# Altium schematic sheet MAIN_POWER.SchDoc
size A3; SheetNumber: 19; SheetTotal: 22
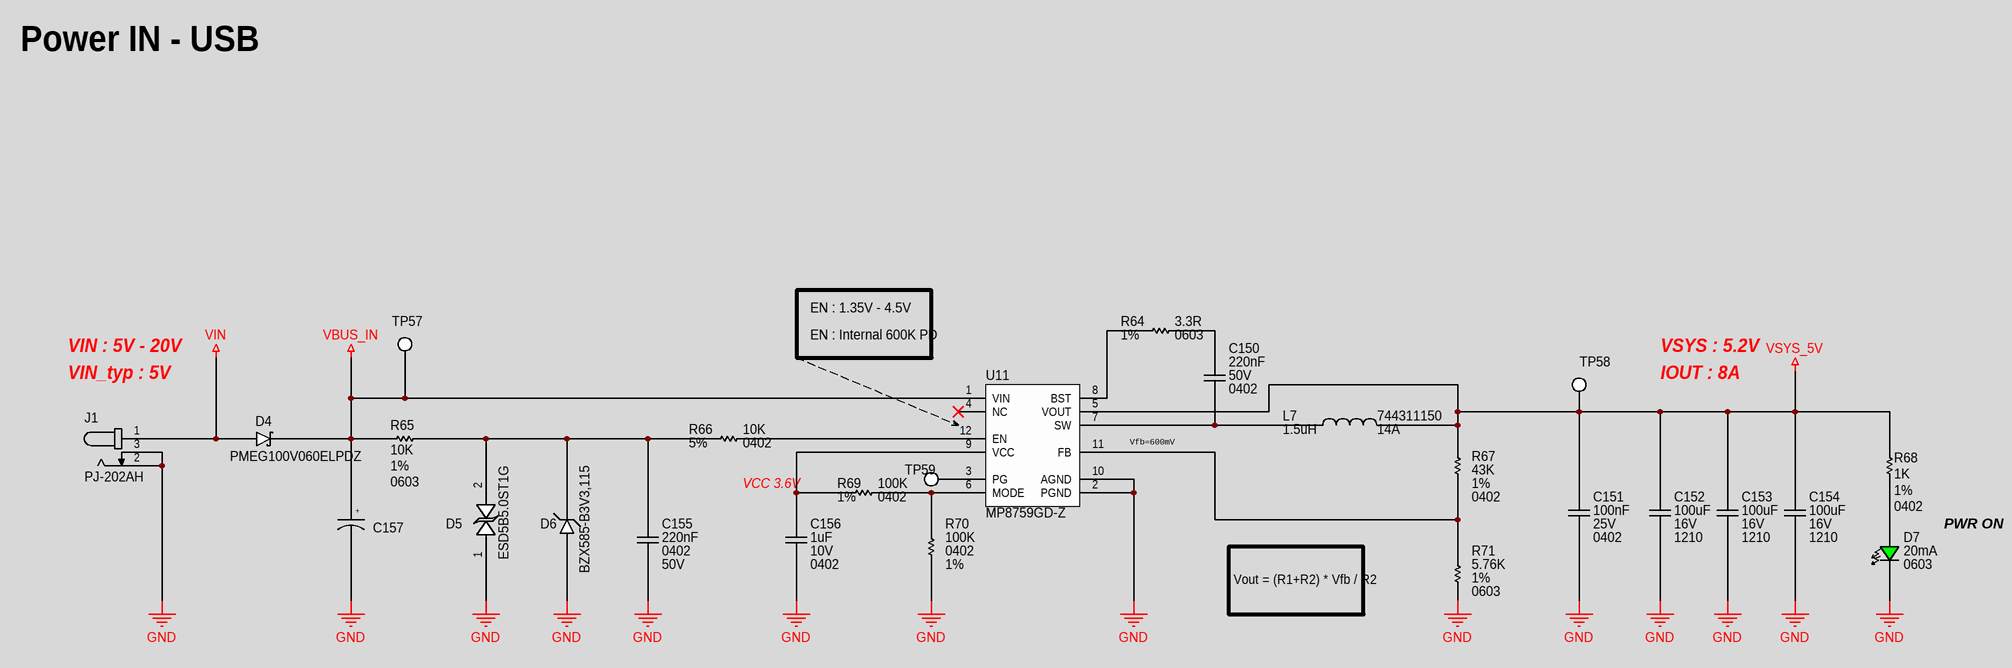
[diagram p0: MAIN_POWER.SchDoc]

## Parts
C150  Case/Package: 0402  Voltage Rating (DC): 50V  Capacitance: 220nF  [CAP_0402_CAPC1005X05N]  (hidden comment: GRM155R61H224KE01W)
C151  Capacitance: 100nF  Voltage Rating: 25V  Case/Package: 0402  [CAP_0402_CAPC1005X05N]  (hidden comment: CC0402KRX5R8BB104)
C152  Voltage Rating: 16V  Capacitance: 100uF  Case/Package: 1210  [CAP_1210_CAPC3225X270N]  (hidden comment: EMK325ABJ107MM-T)
C153  Voltage Rating: 16V  Capacitance: 100uF  Case/Package: 1210  [CAP_1210_CAPC3225X270N]  (hidden comment: EMK325ABJ107MM-T)
C154  Voltage Rating: 16V  Capacitance: 100uF  Case/Package: 1210  [CAP_1210_CAPC3225X270N]  (hidden comment: EMK325ABJ107MM-T)
C155  Case/Package: 0402  Voltage Rating (DC): 50V  Capacitance: 220nF  [CAP_0402_CAPC1005X05N]  (hidden comment: GRM155R61H224KE01W)
C156  Voltage Rating: 10V  Capacitance: 1uF  Case/Package: 0402  [CAP_0402_CAPC1005X05N]  (hidden comment: GRM155C81A105KA12D)
C157  UUD1H101MNL1GS  [CAP_POLA_UD(8X10)]  (value not drawn)
D4  PMEG100V060ELPDZ  [DIO_SCKTY_PMEG060V100EPDAZ]
D5  ESD5B5.0ST1G  [DIO_TVS_SODFL1608X70N]
D6  BZX585-B3V3,115  [DIO_ZENER_BZX585B3V3115]
D7  Test Current: 20mA  Case/Package: 0603  [LED_0603-GREEN]  (hidden comment: LTST-C191KGKT)
J1  PJ-202AH  [CONN_CUI_PJ-202AH]
L7  744311150  Saturation Current: 14A  Inductance: 1.5uH  [IND_WE-HCI_7030/7040/705023]
R64  Tolerance: 1%  Resistance: 3.3R  Case Code (Imperial): 0603  [RES_0603_RESC1608X04N]  (hidden comment: RK73H1JTTD3R30F)
R65  Resistance: 10K  Tolerance: 1%  Case/Package: 0603  [RES_0603_RESC1608X04N]  (hidden comment: AC0603FR-1010KL)
R66  Tolerance: 5%  Resistance: 10K  Case/Package: 0402  [RES_0402_RESC1005X04N]  (hidden comment: ERJ-2GEJ103X)
R67  Tolerance: 1%  Resistance: 43K  Case/Package: 0402  [RES_0402_RESC1005X04N]  (hidden comment: CRCW040243K0FKED)
R68  Resistance: 1K  Tolerance: 1%  Case/Package: 0402  [RES_0402_RESC1005X04N]  (hidden comment: ERJ-2RKF1001X)
R69  Resistance: 100K  Tolerance: 1%  Case/Package: 0402  [RES_0402_RESC1005X04N]  (hidden comment: RC0402FR-07100KL)
R70  Resistance: 100K  Tolerance: 1%  Case/Package: 0402  [RES_0402_RESC1005X04N]  (hidden comment: RC0402FR-07100KL)
R71  Tolerance: 1%  Resistance: 5.76K  Case/Package: 0603  [RES_0603_RESC1608X04N]  (hidden comment: RC0603FR-075K76L)
TP57  NO COMPONENT  [TP_PAD_0.8MM_SMD_ROUND]  (value not drawn)  (no BOM)
TP58  NO COMPONENT  [TP_PAD_0.8MM_SMD_ROUND]  (value not drawn)  (no BOM)
TP59  NO COMPONENT  [TP_PAD_1.6MM_SMD_ROUND]  (value not drawn)  (no BOM)
U11  MP8759GD-Z  [IC_REG_MP8759GDZ]

## Nets
GND: C151.1 C152.1 C153.1 C154.1 C155.1 C156.1 C157.2 D5.1(A1) D6.2(A) D7.1(C) J1.2 J1.3 R70.1 R71.1 U11.2(PGND) U11.10(AGND)
VBUS_IN: C157.1 D4.K R65.2 TP57.1 U11.1(VIN)
VIN: D4.A J1.1
VSYS_5V: C151.2 C152.2 C153.2 C154.2 L7.2 R67.2 R68.2 TP58.1 U11.5(VOUT)
NetC150_1: C150.1 L7.1 U11.7(SW)
NetC150_2: C150.2 R64.2
NetC155_2: C155.2 D5.2(A2) D6.1(K) R65.1 R66.1
NetC156_2: C156.2 R69.1 U11.9(VCC)
NetD7_2: D7.2(A) R68.1
NetR64_1: R64.1 U11.8(BST)
NetR66_2: R66.2 U11.12(EN)
NetR67_1: R67.1 R71.2 U11.11(FB)
NetR69_2: R69.2 R70.2 U11.6(MODE)
NetTP59_1: TP59.1 U11.3(PG)

Not connected (* = marked no-connect by the designer): U11 4(NC)*

## Notes on the sheet
- Power IN - USB
- VIN : 5V - 20V
- EN : 1.35V - 4.5V
- EN : Internal 600K PD
- VSYS : 5.2V
- VIN_typ : 5V
- IOUT : 8A
- VCC 3.6V
- Vfb=600mV
- PWR ON
- Vout = (R1+R2) * Vfb / R2
- PCB Des :
- Approv By :
- Project Title :
- Sheet Title :
- Date :
- PCB Version :
- Size :
- A3
- Page :
- PCB Revision :
- (in symbol CAP_100UF_50V_POL) +

## Library data of the parts
C150 C155 = CAP_0.22UF_50V_X5R_0402: Multilayer Ceramic Capacitor, 0.22 uF, 50 VDC, ± 10%, X5R, 0402 [1005 Metric]; Manufacturer: Murata; Material: 4241ConductorMaterial; Dielectric: 1537DielectricType; Supplier 1: Digi-Key; Manufacturer Part Number: GRM155R61H224KE01W; RoHS: No; Category: Ceramic Capacitors; Stock 1: 74638; Pricing 1: 1=0.1, 10=0.048, 50=0.0272, 100=0.0212, 500=0.01592, 1000=0.01251, 2500=0.01138, 5000=0.01046 (USD); Min Operating Temperature: -55°C; Max Operating Temperature: 85°C; Voltage Rating: 50V; Length: 1mm; Width: 500um; Height: 550um; Thickness: 500um; Supplier Part Number 1: 490-GRM155R61H224KE01WCT-ND
C151 = CAP_100NF_25V_X7R_0402: Multilayer Ceramic Capacitor, 0.1 uF, 25 V, ± 10%, X7R, 0402 [1005 Metric]; Manufacturer: Yageo; Material: 4241ConductorMaterial; Dielectric: X5R; Temperature Coefficient: 30ppm/°C; Supplier 1: Digikey; Manufacturer Part Number: CC0402KRX5R8BB104; RoHS: Yes; Category: Ceramic Capacitors; Stock 1: 3706055; Pricing 1: 1=0.1, 10=0.037, 50=0.021, 100=0.0162, 500=0.01224, 1000=0.00961, 2500=0.00874, 5000=0.00804 (USD); Mount: Surface Mount; Case Code (Metric): 1005; Case Code (Imperial): 0402; Min Operating Temperature: -55°C; Max Operating Temperature: 85°C; Tolerance: 10%; Packaging: Tape and Reel; Voltage Rating (DC): 25V; Series: CC; RoHS Compliant: Yes; Lead Free: 5697LeadFree; Halogen Free: 5694HalogenFree; ComponentLink1URL: http://www.mouser.com/ds/2/447/UPY-GPHC_X5R_4V-to-50V_25-1131599.pdf?src-supplier=Mouser; ComponentLink1Description: http://www.mouser.com/ds/2/447/UPY-GPHC_X5R_4V-to-50V_25-1131599.pdf?src-supplier=Mouser; ComponentLink2URL: https://datasheet.octopart.com/CC0402KRX5R8BB104-Yageo-datasheet-137700082.pdf?src-supplier=Future+Electronics; ComponentLink2Description: https://datasheet.octopart.com/CC0402KRX5R8BB104-Yageo-datasheet-137700082.pdf?src-supplier=Future+Electronics; ComponentLink3URL: http://www.yageo.com/documents/recent/UPY-GPHC_X5R_4V-to-50V_25.pdf?src-supplier=Digikey; ComponentLink3Description: http://www.yageo.com/documents/recent/UPY-GPHC_X5R_4V-to-50V_25.pdf?src-supplier=Digikey; ComponentLink4URL: https://datasheet.octopart.com/CC0402KRX5R8BB104-Yageo-datasheet-140260304.pdf?src-supplier=Newark; ComponentLink4Description: https://datasheet.octopart.com/CC0402KRX5R8BB104-Yageo-datasheet-140260304.pdf?src-supplier=Newark; ComponentLink5URL: https://datasheet.octopart.com/CC0402KRX5R8BB104-Yageo-datasheet-170350636.pdf?src-supplier=Future+Electronics; ComponentLink5Description: https://datasheet.octopart.com/CC0402KRX5R8BB104-Yageo-datasheet-170350636.pdf?src-supplier=Future+Electronics; ComponentLink6URL: http://www.yageo.com/documents/recent/UPY-GPHC_X5R_4V-to-50V-16.pdf?src-supplier=Future+Electronics; ComponentLink6Description: http://www.yageo.com/documents/recent/UPY-GPHC_X5R_4V-to-50V-16.pdf?src-supplier=Future+Electronics; Supplier Part Number 1: 311-1697-6-ND
C152-C154 = CAP_100UF_16V_X5R_1210: Multilayer Ceramic Capacitor, 100 uF, 16 V, ± 20%, X5R, 1210 [3225 Metric]; Manufacturer: Taiyo Yuden; Material: 4241ConductorMaterial; Supplier 1: Digikey; Manufacturer Part Number: EMK325ABJ107MM-T; RoHS: Yes; Category: Ceramic Capacitors; Stock 1: 503358; Pricing 1: 1=1.73, 10=1.295, 50=1.1816, 100=0.9681 (USD); Mount: Surface Mount; Case Code (Metric): 3225; Case Code (Imperial): 1210; Min Operating Temperature: -55°C; Max Operating Temperature: 85°C; Tolerance: 20%; Packaging: Tape and Reel; Package Quantity: 500; Voltage Rating (DC): 16V; Dielectric: X5R; Termination: SMD/SMT; Series: M; Length: 3.2mm; Width: 2.5mm; Height: 2.5mm; Reach SVHC Compliant: No; RoHS Compliant: Yes; ComponentLink1URL: http://www.farnell.com/datasheets/1497285.pdf?src-supplier=Farnell; ComponentLink1Description: http://www.farnell.com/datasheets/1497285.pdf?src-supplier=Farnell; Supplier Part Number 1: 587-3152-1-ND
C156 = CAP_1UF_10V_X6S_0402: 0402 10 V 1 uF ±10% Tolerance X6S Multilayer Ceramic Capacitor; Manufacturer: Murata; Supplier 1: Digikey; Manufacturer Part Number: GRM155C81A105KA12D; RoHS: Yes; Category: Ceramic Capacitors; Stock 1: 2486564; Pricing 1: 1=0.1, 10=0.045, 50=0.026, 100=0.0202, 500=0.01518, 1000=0.01192, 2500=0.01084, 5000=0.00997 (USD); Mount: Surface Mount; Case Code (Metric): 1005; Material: Ceramic; Case Code (Imperial): 0402; Weight: 0.000212oz; Min Operating Temperature: -55°C; Max Operating Temperature: 105°C; Dielectric: X6S; Packaging: Tape and Reel; Termination: SMD/SMT; Voltage Rating (DC): 10V; Package Quantity: 10000; Series: GRM; Length: 1mm; Width: 0.5mm; Height: 0.5mm; Thickness: 0.022inch; Lead Free: Lead Free; RoHS Compliant: Yes; ComponentLink1URL: http://www.mouser.com/ds/2/281/c02e-2905.pdf?src-supplier=Mouser; ComponentLink1Description: http://www.mouser.com/ds/2/281/c02e-2905.pdf?src-supplier=Mouser; ComponentLink2URL: https://datasheet.octopart.com/GRM155C81A105KA12D-Murata-datasheet-22122223.pdf?src-supplier=Future+Electronics; ComponentLink2Description: https://datasheet.octopart.com/GRM155C81A105KA12D-Murata-datasheet-22122223.pdf?src-supplier=Future+Electronics; ComponentLink3URL: https://datasheet.octopart.com/GRM155C81A105KA12D-Murata-datasheet-149522926.pdf?src-supplier=Newark; ComponentLink3Description: https://datasheet.octopart.com/GRM155C81A105KA12D-Murata-datasheet-149522926.pdf?src-supplier=Newark; ComponentLink4URL: http://search.murata.co.jp/Ceramy/image/img/A01X/G101/ENG/GRM155C81A105KA12-01.pdf?src-supplier=Digikey; ComponentLink4Description: http://search.murata.co.jp/Ceramy/image/img/A01X/G101/ENG/GRM155C81A105KA12-01.pdf?src-supplier=Digikey; ComponentLink5URL: http://search.murata.co.jp/Ceramy/image/img/A01X/partnumbering_e_01.pdf?src-supplier=Digikey; ComponentLink5Description: http://search.murata.co.jp/Ceramy/image/img/A01X/partnumbering_e_01.pdf?src-supplier=Digikey; ComponentLink6URL: https://datasheet.octopart.com/GRM155C81A105KA12D-Murata-datasheet-165579666.pdf?src-supplier=TME; ComponentLink6Description: https://datasheet.octopart.com/GRM155C81A105KA12D-Murata-datasheet-165579666.pdf?src-supplier=TME; Supplier Part Number 1: 490-12699-6-ND; Tolerance: 10%
C157 = CAP_100UF_50V_POL: Radial Can - SMD ALUMINUM ELECTROLYTIC CAPACITOR UUD 50V 100muF ±20% 0.315Dia 8.00mm; Manufacturer: Nichicon; Dielectric Material: Aluminium; Ripple Current (AC): 300mA; Impedance: 340mR; Capacitance: 100uF; Leakage Current: 3uA; Life (Hours): 5000Hour; Dissipation Factor: 0.14%; Polarity: 5066Direction; Lead Diameter: 1.1mm; Supplier 1: Mouser; Manufacturer Part Number: UUD1H101MNL1GS; RoHS: Yes; Category: Aluminum Electrolytic Capacitors; Stock 1: 2204; Pricing 1: 1=0.53, 10=0.313, 50=0.313, 100=0.202, 500=0.202, 1000=0.171, 2500=0.151, 10000=0.138, 25000=0.136, 50000=0.131 (USD); Case/Package: Radial; Number of Pins: 2; Min Operating Temperature: -55°C; Max Operating Temperature: 105°C; Tolerance: 20%; Voltage Rating (DC): 50V; Package Quantity: 500; Ripple Current: 300mA; Packaging: Tape and Reel; Voltage Rating: 50V; Termination: SMD/SMT; Voltage: 50V; Series: UD; Construction: Cylindrical; Voltage Rating (AC): 50V; Diameter: 8mm; Length: 10mm; Height: 10mm; Lead Pitch: 3.1mm; Height - Seated (Max): 0.394inch; Radiation Hardening: No; Reach SVHC Compliant: No; Lead Free: Lead Free; RoHS Compliant: Yes; ComponentLink1URL: https://datasheet.ciiva.com/11781/0900766b80fa39e7-11781901.pdf?src-supplier=Rs; ComponentLink1Description: https://datasheet.ciiva.com/11781/0900766b80fa39e7-11781901.pdf?src-supplier=Rs; ComponentLink2URL: https://datasheet.ciiva.com/28458/e-ud-28458117.pdf?src-supplier=Element14; ComponentLink2Description: https://datasheet.ciiva.com/28458/e-ud-28458117.pdf?src-supplier=Element14; ComponentLink3URL: https://datasheet.ciiva.com/28458/1910936-28458133.pdf?src-supplier=Element14; ComponentLink3Description: https://datasheet.ciiva.com/28458/1910936-28458133.pdf?src-supplier=Element14; ComponentLink4URL: https://datasheet.ciiva.com/7781/66055-7781450.pdf?src-supplier=Element14; ComponentLink4Description: https://datasheet.ciiva.com/7781/66055-7781450.pdf?src-supplier=Element14; ComponentLink5URL: https://datasheet.ciiva.com/5362/e-ud-5362134.pdf?src-supplier=Mouser; ComponentLink5Description: https://datasheet.ciiva.com/5362/e-ud-5362134.pdf?src-supplier=Mouser; Supplier Part Number 1: 647-UUD1H101MNL
D4 = DIO_SCTKY_100V_6A_PMEG100V060ELPDZ: DIODESCHOTTKY100V6ACFP15; Manufacturer: Nexperia; Supplier 1: Digikey; Manufacturer Part Number: PMEG100V060ELPDZ; RoHS: Yes; Category: Schottky Diodes; Stock 1: 60422; Pricing 1: 1=0.58, 10=0.504, 100=0.3491, 500=0.29166 (USD); RoHS Compliant: Yes; ComponentLink1URL: http://www.farnell.com/datasheets/2341403.pdf?src-supplier=Farnell; ComponentLink1Description: http://www.farnell.com/datasheets/2341403.pdf?src-supplier=Farnell; ComponentLink2URL: https://datasheet.octopart.com/PMEG100V060ELPDZ-Nexperia-datasheet-87796136.pdf?src-supplier=Future+Electronics; ComponentLink2Description: https://datasheet.octopart.com/PMEG100V060ELPDZ-Nexperia-datasheet-87796136.pdf?src-supplier=Future+Electronics
D5 = DIO_TVS_5.8V_ESD5B5.0ST1G_1: ESD5B5.0S Series 5.8 V 50 W 32 pF SMT ESD Protection Diode - SOD-523
D6 = DIO_ZENER_3.3V_300mW_BZX585-B3V3,115: DIODE ZENER 3.3V 300MW SOD523; Manufacturer: Nexperia; Supplier 1: Mouser; Manufacturer Part Number: BZX585-B3V3,115; RoHS: Yes; Category: Zener Diodes; Stock 1: 47007; Pricing 1: 1=0.38, 10=0.258, 50=0.258, 100=0.105, 1000=0.073, 3000=0.054, 9000=0.048, 10000=0.048, 24000=0.044, 45000=0.042, 99000=0.037 (USD); RoHS Compliant: Yes; ComponentLink1URL: http://www.farnell.com/datasheets/2174102.pdf?src-supplier=Farnell; ComponentLink1Description: http://www.farnell.com/datasheets/2174102.pdf?src-supplier=Farnell; ComponentLink2URL: https://assets.nexperia.com/documents/data-sheet/BZX585_SERIES.pdf?src-supplier=Digikey; ComponentLink2Description: https://assets.nexperia.com/documents/data-sheet/BZX585_SERIES.pdf?src-supplier=Digikey; ComponentLink3URL: https://datasheet.octopart.com/BZX585-B3V3%2C115-Nexperia-datasheet-81456219.pdf?src-supplier=Future+Electronics; ComponentLink3Description: https://datasheet.octopart.com/BZX585-B3V3%2C115-Nexperia-datasheet-81456219.pdf?src-supplier=Future+Electronics; Supplier Part Number 1: 771-BZX585-B3V3115
D7 = LED_DIO_GREEN_20mA_0603: LTST-C191KGKT Lite-On LED, green, 18-71mcd, 130, 1.9V-2.4V SMD, 0603 1.6x0.8x0.55mm RoHS; Manufacturer: Vishay Lite-On; Lens Color: Colorless; Luminous Intensity: 35mcd; Viewing Angle: 130°; Forward Voltage: 2V; Dominant Wavelength: 571nm; Lens Transparency: Clear; Wavelength: 574nm; Lens Style: Flat,Rectangular,Colorless; Number of LEDs: 1; Max Power Dissipation: 75mW; Lens Size: 0.8mm; Supplier 1: Digi-Key; Manufacturer Part Number: LTST-C191KGKT; RoHS: Yes; Stock 1: 1556161; Pricing 1: 1=0.26, 10=0.143, 100=0.0663, 500=0.0612, 1000=0.04794, 2000=0.04693 (USD); Mount: Surface Mount; Number of Pins: 2; Color: Green; Case Code (Metric): 1608; Case Code (Imperial): 0603; Min Operating Temperature: -55°C; Max Operating Temperature: 85°C; Packaging: Tape and Reel; Series: -; Length: 1.6mm; Width: 0.8mm; Height: 0.65mm; RoHS Compliant: Yes; Lead Free: Lead Free; ComponentLink1URL: https://datasheet.ciiva.com/2109/ltst-c191kgkt-2109973.pdf?src-supplier=Digi-Key; ComponentLink1Description: https://datasheet.ciiva.com/2109/ltst-c191kgkt-2109973.pdf?src-supplier=Digi-Key; Supplier Part Number 1: 160-1446-1-ND
J1 = CONN_DC_JACK_2X6.5mm_PJ-202AH: 2.0 x 6.5 mm, 5.0 A, Horizontal, Through Hole, Kinked Pins, Dc Power Jack Connector; Manufacturer: CUI Devices; Body Color: Black; Shielding: Unshielded; Gender: Male; Supplier 1: Digi-Key; Manufacturer Part Number: PJ-202AH; RoHS: Yes; Category: Power Connectors; Stock 1: 143167; Pricing 1: 1=0.78, 25=0.6528, 100=0.5988, 500=0.48902, 2500=0.40274, 10000=0.36162 (USD); Mount: Through Hole; Contact Plating: Silver; Contact Material: Brass; Housing Material: PBT; Min Operating Temperature: -25°C; Max Operating Temperature: 85°C; Connector Type: Jack; Termination: Kinked Pin; Series: -; Flammability Rating: UL94 V-0; ComponentLink1URL: https://datasheet.octopart.com/PJ-202AH-CUI-Devices-datasheet-137760703.pdf?src-supplier=Future+Electronics; ComponentLink1Description: https://datasheet.octopart.com/PJ-202AH-CUI-Devices-datasheet-137760703.pdf?src-supplier=Future+Electronics; ComponentLink2URL: https://datasheet.octopart.com/PJ-202AH-CUI-datasheet-54017.pdf?src-supplier=Digi-Key; ComponentLink2Description: https://datasheet.octopart.com/PJ-202AH-CUI-datasheet-54017.pdf?src-supplier=Digi-Key; ComponentLink3URL: https://datasheet.octopart.com/PJ-202AH-CUI-Devices-datasheet-141002001.pdf?src-supplier=Electro+Sonic; ComponentLink3Description: https://datasheet.octopart.com/PJ-202AH-CUI-Devices-datasheet-141002001.pdf?src-supplier=Electro+Sonic; Supplier Part Number 1: CP-202AH-ND
L7 = IND_1.5uH_11A_744311150: Power Choke Shielded Wirewound 1.5uH/1.12uH 20% 100KHz 11A 6.6mOhm DCR T/R; Manufacturer: Wurth Electronics; DC Resistance (DCR): 6.6mR; Self Resonant Frequency: 72MHz; Series Resistance: 6.6R; Supplier 1: Digikey; Manufacturer Part Number: 744311150; RoHS: Yes; Category: Fixed Inductors; Stock 1: 12000; Pricing 1: 1=3.8, 10=3.72, 50=3.44, 100=3.29, 500=3.08 (USD); Mount: Surface Mount; Case/Package: 7040; Number of Pins: 2; Min Operating Temperature: -40°C; Max Operating Temperature: 150°C; Tolerance: 20%; Packaging: Tape and Reel; Shielding: Shielded; Package Quantity: 1; Test Frequency: 100kHz; Max DC Current: 11A; Termination: SMD/SMT; Series: WE-HCI; Inductance Tolerance: 20%; Current Rating: 11A; RMS Current (Irms): 11A; Length: 7mm; Width: 6.9mm; Height: 3.8mm; Height - Seated (Max): 0.157inch; Depth: 7.2mm; Ratings: AEC-Q200; RoHS Compliant: Yes; Lead Free: Lead Free; Reach SVHC Compliant: Unknown; Military Standard: Not; ComponentLink1URL: https://datasheet.ciiva.com/7354/744311150-7354372.pdf?src-supplier=Newark; ComponentLink1Description: https://datasheet.ciiva.com/7354/744311150-7354372.pdf?src-supplier=Newark; ComponentLink2URL: https://datasheet.ciiva.com/7765/1735736-7765005.pdf?src-supplier=Element14; ComponentLink2Description: https://datasheet.ciiva.com/7765/1735736-7765005.pdf?src-supplier=Element14; ComponentLink3URL: https://datasheet.ciiva.com/4954/744311150-54367-4954829.pdf?src-supplier=Mouser; ComponentLink3Description: https://datasheet.ciiva.com/4954/744311150-54367-4954829.pdf?src-supplier=Mouser; ComponentLink4URL: https://datasheet.ciiva.com/11801/0900766b80f886c8-11801798.pdf?src-supplier=Rs; ComponentLink4Description: https://datasheet.ciiva.com/11801/0900766b80f886c8-11801798.pdf?src-supplier=Rs; ComponentLink5URL: https://datasheet.ciiva.com/26307/744311150-eng-tds-26307909.pdf?src-supplier=Distrelec; ComponentLink5Description: https://datasheet.ciiva.com/26307/744311150-eng-tds-26307909.pdf?src-supplier=Distrelec; ComponentLink6URL: https://datasheet.ciiva.com/6692/744311150-6692686.pdf?src-supplier=Digikey; ComponentLink6Description: https://datasheet.ciiva.com/6692/744311150-6692686.pdf?src-supplier=Digikey; ComponentLink7URL: https://datasheet.ciiva.com/6692/744311150-6692685.pdf?src-supplier=Digikey; ComponentLink7Description: https://datasheet.ciiva.com/6692/744311150-6692685.pdf?src-supplier=Digikey; ComponentLink8URL: https://datasheet.ciiva.com/6692/744311150-6692687.pdf?src-supplier=Digikey; ComponentLink8Description: https://datasheet.ciiva.com/6692/744311150-6692687.pdf?src-supplier=Digikey; ComponentLink9URL: https://datasheet.ciiva.com/48691/001087434-da-01-ml-we-hci-smd-hochstromind-744311150-de-en-48691386.pdf?src-supplier=Conrad; ComponentLink9Description: https://datasheet.ciiva.com/48691/001087434-da-01-ml-we-hci-smd-hochstromind-744311150-de-en-48691386.pdf?src-supplier=Conrad; Supplier Part Number 1: 732-1150-1-ND
R64 = RES_3.3R_1%_125mW_0603: Thick Film Chip Resistor 0603 SMD 3.3 Ohm 1% 0.125W(1/8W) 200ppm/C; Manufacturer: KOA Speer; Voltage Rating: 50V; Power Rating: 100mW; Temperature Coefficient: 200ppm/°C; Max Power Dissipation: 125mW; Supplier 1: Digikey; Manufacturer Part Number: RK73H1JTTD3R30F; RoHS: Yes; Category: Chip SMD Resistors; Stock 1: 68759; Pricing 1: 1=0.1, 10=0.023, 50=0.0146, 100=0.0122, 500=0.00832, 1000=0.00717 (USD); Case/Package: 0603; Number of Pins: 2; Case Code (Metric): 1608; Min Operating Temperature: -55°C; Max Operating Temperature: 155°C; Packaging: Tape and Reel; Resistor Type: Thick Film; Termination: SMD/SMT; Series: RK73H; Construction: Rectangular; Resistance Tolerance: 1%; Features: Moisture Resistant,Automotive AEC-Q200; Number of Terminations: 2; Length: 1.6mm; Depth: 0.8mm; Ratings: AEC-Q200; Military Standard: Not; Lead Free: Lead Free; RoHS Compliant: Yes; ComponentLink1URL: https://datasheet.ciiva.com/5556/rk73h-5556827.pdf?src-supplier=Mouser; ComponentLink1Description: https://datasheet.ciiva.com/5556/rk73h-5556827.pdf?src-supplier=Mouser; ComponentLink2URL: https://datasheet.ciiva.com/48426/rk73h-series-eng-jap-tds-48426603.pdf?src-supplier=Distrelec; ComponentLink2Description: https://datasheet.ciiva.com/48426/rk73h-series-eng-jap-tds-48426603.pdf?src-supplier=Distrelec; ComponentLink3URL: https://datasheet.ciiva.com/7816/549017-7816815.pdf?src-supplier=Element14; ComponentLink3Description: https://datasheet.ciiva.com/7816/549017-7816815.pdf?src-supplier=Element14; Supplier Part Number 1: 2019-RK73H1JTTD3R30FCT-ND
R65 = RES_10K_1%_100mW_0603: Chip Resistor Automotive Grade Thick Film 0603 10kOhm 1% Paper T/R; Manufacturer: Yageo; Voltage Rating: 50V; Power Rating: 100mW; Temperature Coefficient: 100ppm/°C; Manufacturer Part Number: AC0603FR-1010KL; RoHS: Yes; Category: Chip SMD Resistors; Stock 1: 172891; Pricing 1: 1=0.10000, 10=0.02500, 100=0.01030, 1000=0.00463, 2500=0.00402, 5000=0.00332 (USD); Case Code (Imperial): 0603; Case Code (Metric): 1608; Weight: 7.1E-05oz; Min Operating Temperature: -55°C; Max Operating Temperature: 155°C; Packaging: Tape and Reel; Termination: SMD/SMT; Series: AC; Length: 1.6mm; Width: 0.8mm; Height: 0.45mm; RoHS Compliant: Yes; ComponentLink1URL: http://www.mouser.com/ds/2/447/yageodocoutput-1111992.pdf?src-supplier=Mouser; ComponentLink1Description: http://www.mouser.com/ds/2/447/yageodocoutput-1111992.pdf?src-supplier=Mouser; Supplier 1: Digi-Key; Supplier 2: Newark; Supplier 3: Avnet; Supplier Part Number 1: 13-AC0603FR-1010KLCT-ND; Supplier Part Number 2: 49AK0662; Supplier Part Number 3: 49AK0662
R66 = RES_10K_5%_100mW_0402: Res Thick Film 0402 10K Ohm 5% 1/10W ±200ppm/°C Molded SMD Punched Carrier T/R; Manufacturer: Panasonic; Power Rating: 100mW; Voltage Rating: 50V; Supplier 1: Digi-Key; Manufacturer Part Number: ERJ-2GEJ103X; RoHS: Yes; Category: Chip SMD Resistors; Stock 1: 4696986; Pricing 1: 1=0.1, 10=0.021, 50=0.0132, 100=0.011, 500=0.00744, 1000=0.00639, 5000=0.00464 (USD); Mount: Surface Mount; Contact Plating: Tin; Case Code (Metric): 1005; Case Code (Imperial): 0402; Size Code: 0402; Min Operating Temperature: -55°C; Max Operating Temperature: 155°C; Temperature Coefficient: 200ppm/°C; Packaging: Cut Tape; Resistor Type: Thick Film; Package Quantity: 10000; Number of Terminations: 2; Termination: SMD/SMT; Max Power Dissipation: 100mW; Features: Automotive AEC-Q200; Series: ERJ; Resistance Tolerance: 5%; Technology: THICK FILM; Voltage Rating (DC): 50V; Length: 1mm; Width: 0.5mm; Height: 0.35mm; Depth: 0.5mm; Ratings: AEC-Q200; Radiation Hardening: No; Reach SVHC Compliant: No; RoHS Compliant: Yes; Lead Free: 5697LeadFree; ComponentLink1URL: https://datasheet.ciiva.com/27055/1935721-27055112.pdf?src-supplier=Jameco; ComponentLink1Description: https://datasheet.ciiva.com/27055/1935721-27055112.pdf?src-supplier=Jameco; ComponentLink2URL: https://datasheet.ciiva.com/11821/0900766b80f806dd-11821170.pdf?src-supplier=Rs; ComponentLink2Description: https://datasheet.ciiva.com/11821/0900766b80f806dd-11821170.pdf?src-supplier=Rs; ComponentLink3URL: https://datasheet.ciiva.com/43460/1678796-43460391.pdf?src-supplier=Farnell; ComponentLink3Description: https://datasheet.ciiva.com/43460/1678796-43460391.pdf?src-supplier=Farnell; ComponentLink4URL: https://datasheet.ciiva.com/22785/1678796-22785949.pdf?src-supplier=Farnell; ComponentLink4Description: https://datasheet.ciiva.com/22785/1678796-22785949.pdf?src-supplier=Farnell; ComponentLink5URL: https://datasheet.ciiva.com/46371/1678796-46371910.pdf?src-supplier=Element14; ComponentLink5Description: https://datasheet.ciiva.com/46371/1678796-46371910.pdf?src-supplier=Element14; ComponentLink6URL: https://datasheet.ciiva.com/28514/1678796-28514154.pdf?src-supplier=Element14; ComponentLink6Description: https://datasheet.ciiva.com/28514/1678796-28514154.pdf?src-supplier=Element14; ComponentLink7URL: https://datasheet.ciiva.com/24070/aoa0000ce1-37422-24070679.pdf?src-supplier=Mouser; ComponentLink7Description: https://datasheet.ciiva.com/24070/aoa0000ce1-37422-24070679.pdf?src-supplier=Mouser; ComponentLink8URL: https://datasheet.ciiva.com/16767/70260739-16767130.pdf?src-supplier=Allied+Electronics; ComponentLink8Description: https://datasheet.ciiva.com/16767/70260739-16767130.pdf?src-supplier=Allied+Electronics; ComponentLink9URL: https://datasheet.ciiva.com/16774/70260739-16774504.pdf?src-supplier=Allied+Electronics; ComponentLink9Description: https://datasheet.ciiva.com/16774/70260739-16774504.pdf?src-supplier=Allied+Electronics; ComponentLink10URL: https://datasheet.ciiva.com/9194/aoa0000ce1-9194140.pdf?src-supplier=Avnet; ComponentLink10Description: https://datasheet.ciiva.com/9194/aoa0000ce1-9194140.pdf?src-supplier=Avnet; Supplier Part Number 1: P10KJCT-ND
R67 = RES_43K_1%_63mW_0402: SMD Chip Resistor, 43 kOhm, ± 1%, 63 mW, 0402 [1005 Metric], Thick Film, General Purpose; Manufacturer: Vishay; Voltage Rating: 50V; Temperature Coefficient: 100ppm/°C; Max Power Dissipation: 63mW; Supplier 1: Digikey; Manufacturer Part Number: CRCW040243K0FKED; RoHS: Yes; Category: Chip SMD Resistors; Stock 1: 55691; Pricing 1: 1=0.1, 10=0.026, 50=0.0164, 100=0.0137, 500=0.00934, 1000=0.00806, 5000=0.00591 (USD); Number of Pins: 2; Weight: 2.3E-05oz; Case Code (Imperial): 0402; Case Code (Metric): 1005; Contact Plating: Tin; Size Code: 0402; Min Operating Temperature: -55°C; Max Operating Temperature: 155°C; Packaging: Tape and Reel; Number of Terminations: 2; Features: Automotive AEC-Q200; Series: CRCW; Power Rating: 63mW; Resistor Type: Thick Film; Termination: SMD/SMT; Voltage Rating (DC): 50V; Resistance Tolerance: 1%; Construction: Rectangular; Technology: THICK FILM; Length: 1mm; Width: 0.5mm; Height: 0.35mm; Depth: 0.5mm; Ratings: AEC-Q200; Radiation Hardening: No; RoHS Compliant: Yes; Lead Free: Lead Free; Military Standard: Not; Reach SVHC Compliant: Unknown; ComponentLink1URL: https://datasheet.ciiva.com/11818/0900766b80d98824-11818093.pdf?src-supplier=Rs; ComponentLink1Description: https://datasheet.ciiva.com/11818/0900766b80d98824-11818093.pdf?src-supplier=Rs; ComponentLink2URL: https://datasheet.ciiva.com/22705/1697337-22705823.pdf?src-supplier=Element14; ComponentLink2Description: https://datasheet.ciiva.com/22705/1697337-22705823.pdf?src-supplier=Element14; ComponentLink3URL: https://datasheet.ciiva.com/2525/dcrcwe3-2525657.pdf?src-supplier=Digikey; ComponentLink3Description: https://datasheet.ciiva.com/2525/dcrcwe3-2525657.pdf?src-supplier=Digikey; ComponentLink4URL: https://datasheet.ciiva.com/2525/dcrcwe3-2525658.pdf?src-supplier=Digikey; ComponentLink4Description: https://datasheet.ciiva.com/2525/dcrcwe3-2525658.pdf?src-supplier=Digikey; ComponentLink5URL: https://datasheet.ciiva.com/2525/dcrcwe3-2525656.pdf?src-supplier=Digikey; ComponentLink5Description: https://datasheet.ciiva.com/2525/dcrcwe3-2525656.pdf?src-supplier=Digikey; ComponentLink6URL: https://datasheet.ciiva.com/16781/70201119-16781838.pdf?src-supplier=Allied+Electronics; ComponentLink6Description: https://datasheet.ciiva.com/16781/70201119-16781838.pdf?src-supplier=Allied+Electronics; ComponentLink7URL: https://datasheet.ciiva.com/3256/dcrcwe3-3256525.pdf?src-supplier=Avnet; ComponentLink7Description: https://datasheet.ciiva.com/3256/dcrcwe3-3256525.pdf?src-supplier=Avnet; ComponentLink8URL: https://datasheet.ciiva.com/16449/dcrcwe3-16449433.pdf?src-supplier=Future+Electronics; ComponentLink8Description: https://datasheet.ciiva.com/16449/dcrcwe3-16449433.pdf?src-supplier=Future+Electronics; ComponentLink9URL: https://datasheet.ciiva.com/3256/dcrcwe3-3256524.pdf?src-supplier=Avnet; ComponentLink9Description: https://datasheet.ciiva.com/3256/dcrcwe3-3256524.pdf?src-supplier=Avnet; Supplier Part Number 1: 541-43.0KLCT-ND
R68 = RES_1K_1%_100mW_0402: RES SMD 1K OHM 1% 1/10W 0402; Manufacturer: Panasonic; Temperature Coefficient: 100ppm/°C; Max Power Dissipation: 100mW; Voltage Rating (DC): 50V; Supplier 1: Digi-Key; Manufacturer Part Number: ERJ-2RKF1001X; RoHS: Yes; Category: Chip SMD Resistors; Stock 1: 2367361; Pricing 1: 1=0.1, 10=0.029, 50=0.0162, 100=0.0119, 500=0.00728, 1000=0.00535, 5000=0.00384 (USD); Mount: Surface Mount; Number of Pins: 2; Case Code (Imperial): 0402; Case Code (Metric): 1005; Contact Plating: Tin; Min Operating Temperature: -55°C; Max Operating Temperature: 155°C; Packaging: Tape and Reel; Number of Terminations: 2; Features: Automotive AEC-Q200; Voltage Rating: 50V; Power Rating: 100mW; Package Quantity: 1; Termination: SMD/SMT; Resistor Type: Thick Film; Series: ERJ; Resistance Tolerance: 1%; Construction: Rectangular; Technology: THICK FILM; Length: 1mm; Width: 0.5mm; Height: 0.35mm; Depth: 0.5mm; Lead Free: Lead Free; RoHS Compliant: Yes; Reach SVHC Compliant: Yes; Military Standard: Not; Supplier Part Number 1: P1.00KLCT-ND
R69 R70 = RES_100K_1%_100mW_0402: SMD Chip Resistor, 100 kOhm, ± 1%, 63 mW, 0402 [1005 Metric], Thick Film, General Purpose; Manufacturer: Yageo; Temperature Coefficient: 100ppm/°C; Power Rating: 63mW; Voltage Rating: 50V; Supplier 1: Digi-Key; Manufacturer Part Number: RC0402FR-07100KL; RoHS: Yes; Category: Chip SMD Resistors; Stock 1: 27579413; Pricing 1: 1=0.1, 10=0.014, 50=0.0084, 100=0.007, 500=0.00464, 1000=0.00396, 5000=0.00282 (USD); Case Code (Metric): 1005; Case Code (Imperial): 0402; Min Operating Temperature: -55°C; Max Operating Temperature: 155°C; Resistor Type: Thick Film; Packaging: Tape and Reel; Package Quantity: 1; Number of Terminations: 2; Termination: SMD/SMT; Max Power Dissipation: 63mW; Features: Moisture Resistant; Series: RC; Resistance Tolerance: 1%; Construction: Rectangular; Technology: THICK FILM; Voltage Rating (AC): 50V; Length: 0.039inch; Width: 0.02inch; Height: 0.016inch; Depth: 0.5mm; Reach SVHC Compliant: No; RoHS Compliant: Yes; Lead Free: 5697LeadFree; Military Standard: Not; ComponentLink1URL: https://datasheet.ciiva.com/11819/0900766b80c66297-11819452.pdf?src-supplier=Rs; ComponentLink1Description: https://datasheet.ciiva.com/11819/0900766b80c66297-11819452.pdf?src-supplier=Rs; ComponentLink2URL: https://datasheet.ciiva.com/22747/1018594-22747509.pdf?src-supplier=Element14; ComponentLink2Description: https://datasheet.ciiva.com/22747/1018594-22747509.pdf?src-supplier=Element14; ComponentLink3URL: https://datasheet.ciiva.com/2453/pyu-r-int-thick-7-2453362.pdf?src-supplier=Digi-Key; ComponentLink3Description: https://datasheet.ciiva.com/2453/pyu-r-int-thick-7-2453362.pdf?src-supplier=Digi-Key; ComponentLink4URL: https://datasheet.ciiva.com/12667/pyu-rc0402-51-rohs-l-6-r-12667930.pdf?src-supplier=Mouser; ComponentLink4Description: https://datasheet.ciiva.com/12667/pyu-rc0402-51-rohs-l-6-r-12667930.pdf?src-supplier=Mouser; ComponentLink5URL: https://datasheet.ciiva.com/15189/getdatasheetpartid-323696-15189334.pdf?src-supplier=Verical; ComponentLink5Description: https://datasheet.ciiva.com/15189/getdatasheetpartid-323696-15189334.pdf?src-supplier=Verical; ComponentLink6URL: https://datasheet.ciiva.com/2453/pyu-r-int-thick-7-2453363.pdf?src-supplier=Digi-Key; ComponentLink6Description: https://datasheet.ciiva.com/2453/pyu-r-int-thick-7-2453363.pdf?src-supplier=Digi-Key; ComponentLink7URL: https://datasheet.ciiva.com/2453/pyu-r-int-thick-7-2453361.pdf?src-supplier=Digi-Key; ComponentLink7Description: https://datasheet.ciiva.com/2453/pyu-r-int-thick-7-2453361.pdf?src-supplier=Digi-Key; Supplier Part Number 1: 311-100KLRCT-ND
R71 = RES_5.7K_1%_100mW_0603: SMD Chip Resistor, 5.76 kOhm, ± 1%, 100 mW, 0603 [1608 Metric], Thick Film, General Purpose; Manufacturer: Yageo; Temperature Coefficient: 100ppm/°C; Power Rating: 100mW; Voltage Rating: 50V; Supplier 1: Digikey; Manufacturer Part Number: RC0603FR-075K76L; RoHS: Yes; Category: Chip SMD Resistors; Stock 1: 274322; Pricing 1: 1=0.1, 10=0.019, 50=0.0116, 100=0.0096, 500=0.00642, 1000=0.00548 (USD); Contact Plating: Tin,Matte; Case Code (Imperial): 0603; Case Code (Metric): 1608; Size Code: 0603; Min Operating Temperature: -55°C; Max Operating Temperature: 155°C; Packaging: Tape and Reel; Package Quantity: 5000; Termination: SMD/SMT; Features: Moisture Resistant; Series: RC; Max Power Dissipation: 100mW; Number of Terminations: 2; Voltage Rating (DC): 50V; Length: 1.6mm; Width: 0.8mm; Height: 0.45mm; RoHS Compliant: Yes; Lead Free: 5697LeadFree; ComponentLink1URL: https://datasheet.ciiva.com/8892/pyu-rc0603-51-rohs-l-4-8892485.pdf?src-supplier=Avnet; ComponentLink1Description: https://datasheet.ciiva.com/8892/pyu-rc0603-51-rohs-l-4-8892485.pdf?src-supplier=Avnet; ComponentLink2URL: https://datasheet.ciiva.com/12575/rc0603-272842-12575338.pdf?src-supplier=Mouser; ComponentLink2Description: https://datasheet.ciiva.com/12575/rc0603-272842-12575338.pdf?src-supplier=Mouser; Supplier Part Number 1: 311-5.76KHRCT-ND
TP57-TP59 = TP_PAD_SMD_Round: Test Point, SMD pad, round, 1.5mm, 1.6mm, 3mm diameter
U11 = IC_REG_BUCK_26V_8A_MP8759GD-Z: Tape & Reel (TR) Active Step-Down Buck DC to DC switching regulator 26V 8A 700kHz -40C~125C TJ; Manufacturer: Monolithic Power Systems; Output Voltage: 600mV; Number of Outputs: 1; Min Input Voltage: 4.5V; Max Output Current: 10A; Output Type: Adjustable; Supplier 1: Digi-Key; Manufacturer Part Number: MP8759GD-Z; RoHS: Yes; Category: Voltage Regulators - Switching; Stock 1: 455; Pricing 1: 1=2.71, 10=2.436, 25=2.2976, 100=1.9577, 250=1.8382, 500=1.60842, 1000=1.3327, 2500=1.24078 (USD); Mount: Surface Mount; Case/Package: QFN; Number of Pins: 14; Contact Plating: Tin,Matte; Min Operating Temperature: -40°C; Max Operating Temperature: 125°C; Max Input Voltage: 26V; Switching Frequency: 700kHz; Operating Supply Voltage: 26V; RoHS Compliant: Yes; ComponentLink1URL: https://www.monolithicpower.com/pub/media/document/MP8759_r1.1.pdf?src-supplier=Digi-Key; ComponentLink1Description: https://www.monolithicpower.com/pub/media/document/MP8759_r1.1.pdf?src-supplier=Digi-Key; ComponentLink2URL: https://datasheet.octopart.com/MP8759GD-Z-Monolithic-Power-Systems-datasheet-104200629.pdf?src-supplier=SHENGYU+ELECTRONICS; ComponentLink2Description: https://datasheet.octopart.com/MP8759GD-Z-Monolithic-Power-Systems-datasheet-104200629.pdf?src-supplier=SHENGYU+ELECTRONICS; ComponentLink3URL: https://datasheet.octopart.com/MP8759GD-Z-Monolithic-Power-Systems-datasheet-155982220.pdf?src-supplier=Monolithic+Power+Systems; ComponentLink3Description: https://datasheet.octopart.com/MP8759GD-Z-Monolithic-Power-Systems-datasheet-155982220.pdf?src-supplier=Monolithic+Power+Systems; Supplier Part Number 1: 1589-1736-1-ND